# EAGLE design pi_zero (EAGLE 9.1.3)
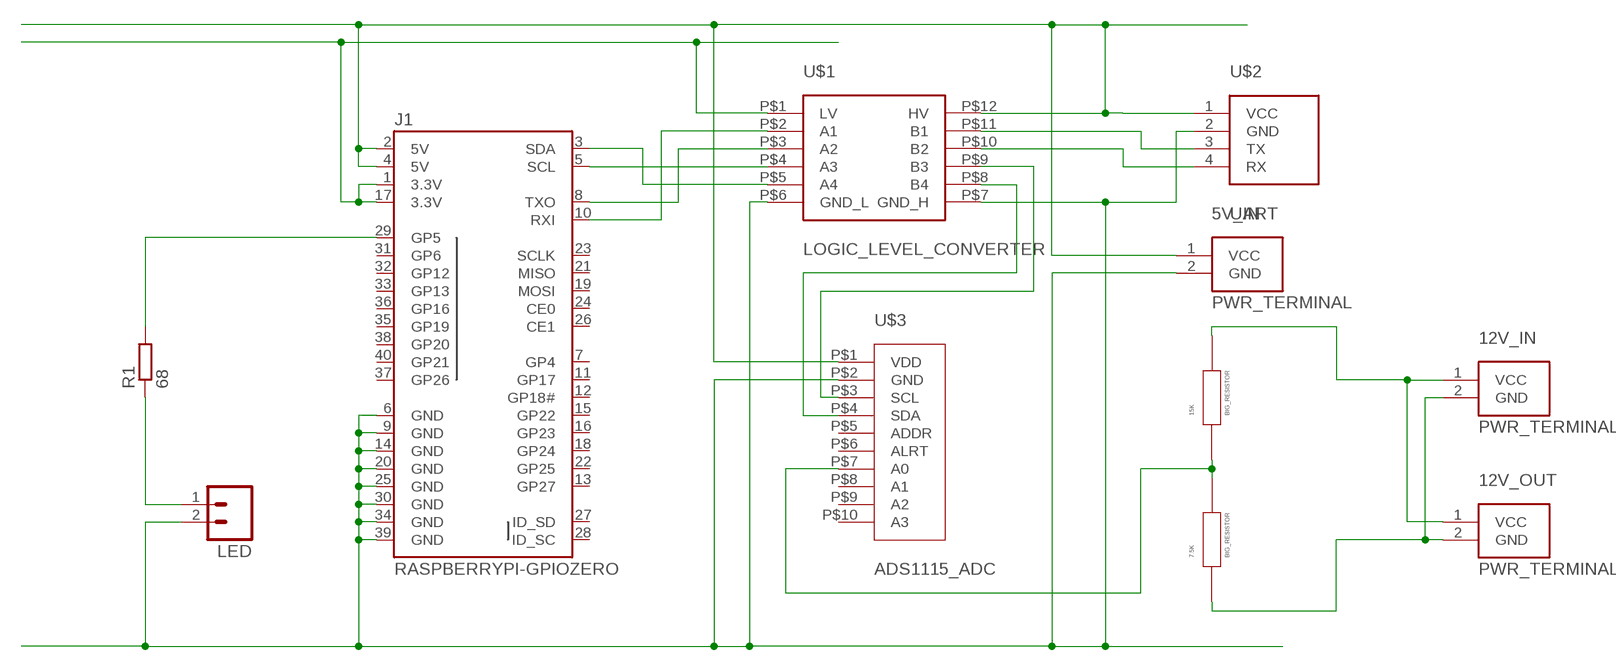
[diagram p0: schematic, sheet 1]

## Parts
5V_IN  PWR_TERMINAL  [PWR_TERMINAL]
7.5K  BIG_RESISTOR  [BIG_RESISTOR]
12V_IN  PWR_TERMINAL  [PWR_TERMINAL]
12V_OUT  PWR_TERMINAL  [PWR_TERMINAL]
15K  BIG_RESISTOR  [BIG_RESISTOR]
J1  RASPBERRYPI-GPIOZERO  [2X20-ZERO]
LED  M02LOCK_LONGPADS  [1X02_LOCK_LONGPADS]
R1  68  R-EU_0204/7  [0204/7]
U$1  LOGIC_LEVEL_CONVERTER  [LOGIC_LEVEL_CONVERTER]
U$2  UART  [I2C_TERM]
U$3  ADS1115_ADC  [ADS1115_ADC]

## Nets
N$1: J1.29(GP5) R1.2
N$2: LED.1 R1.1
N$3: U$1.P$11(B1) U$2.3(TX)
N$5: 5V_IN.1(VCC) J1.2(5V) J1.4(5V) U$1.P$12(HV) U$2.1(VCC) U$3.P$1(VDD)
N$6: J1.1(3.3V) J1.17(3.3V) U$1.P$1(LV)
N$7: 5V_IN.2(GND) J1.6(GND) J1.9(GND) J1.14(GND) J1.20(GND) J1.25(GND) J1.30(GND) J1.34(GND) J1.39(GND) LED.2 U$1.P$6(GND_L) U$1.P$7(GND_H) U$2.2(GND) U$3.P$2(GND)
N$8: 7.5K.P$1 12V_IN.2(GND) 12V_OUT.2(GND)
N$9: U$1.P$10(B2) U$2.4(RX)
N$10: J1.10(RXI) U$1.P$2(A1)
N$11: J1.8(TXO) U$1.P$3(A2)
N$12: 7.5K.P$2 15K.P$1 U$3.P$7(A0)
N$14: U$1.P$9(B3) U$3.P$3(SCL)
N$15: 12V_IN.1(VCC) 12V_OUT.1(VCC) 15K.P$2
N$16: U$1.P$8(B4) U$3.P$4(SDA)
N$17: J1.3(SDA) U$1.P$5(A4)
N$18: J1.5(SCL) U$1.P$4(A3)
Unconnected: J1.7(GP4) J1.11(GP17) J1.12(GP18#) J1.13(GP27) J1.15(GP22) J1.16(GP23) J1.18(GP24) J1.19(MOSI) J1.21(MISO) J1.22(GP25) J1.23(SCLK) J1.24(CE0) J1.26(CE1) J1.27(ID_SD) J1.28(ID_SC) J1.31(GP6) J1.32(GP12) J1.33(GP13) J1.35(GP19) J1.36(GP16) J1.37(GP26) J1.38(GP20) J1.40(GP21) U$3.P$5(ADDR) U$3.P$6(ALRT) U$3.P$8(A1) U$3.P$9(A2) U$3.P$10(A3)

## Library data of the parts
5V_IN 12V_IN 12V_OUT = 000_CropQuant:PWR_TERMINAL
7.5K 15K = 000_CropQuant:BIG_RESISTOR
J1 = 000_CropQuant:RASPBERRYPI-GPIO: Second Generation Raspberry Pi GPIO Header 2x20 pin connector, as found on B, B+, A+ models.
LED = 001_SparkFun-Connectors:M02: Standard 2-pin 0.1" header. Use with - straight break away headers ( PRT-00116) - right angle break away headers (PRT-00553) - swiss pins (PRT-00743) - machine pins (PRT-00117) - female headers (PRT-00115) Molex polarized connector foot print use with: PRT-08233 with associated crimp pins and housings. 2.54_SCREWTERM for use with PRT-10571. 3.5mm Screw Terminal footprints for PRT-08084 5mm Screw Terminal footprints for use with PRT-08432
R1 = resistor:R-EU_: RESISTOR, European symbol
U$1 = 000_CropQuant:LOGIC_LEVEL_CONVERTER
U$2 = 000_CropQuant:UART
U$3 = 000_CropQuant:ADS1115_ADC

## Board
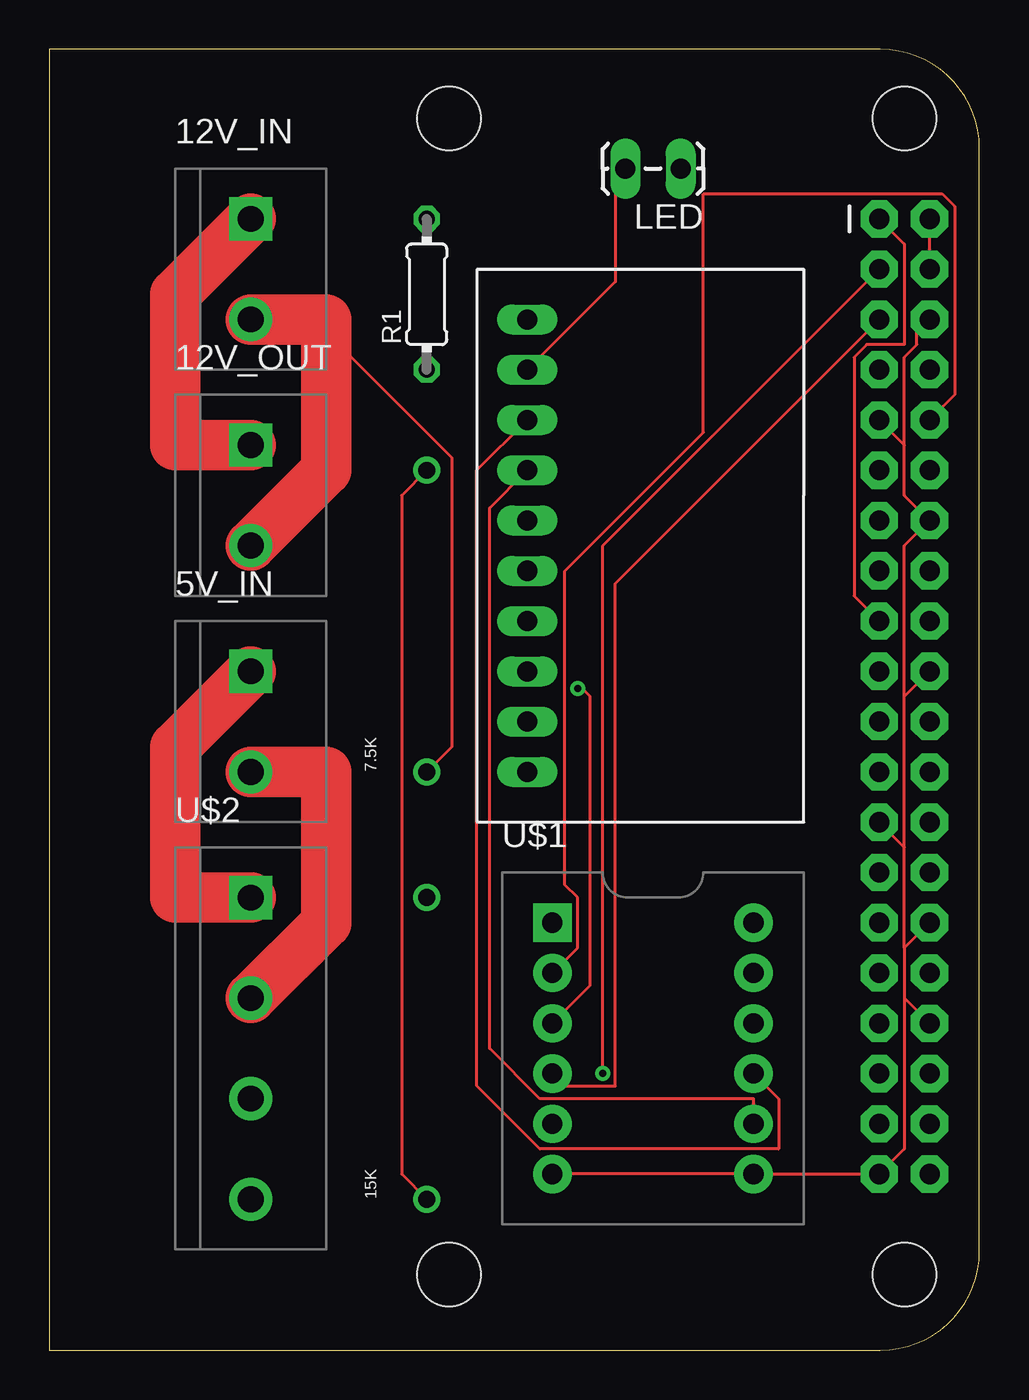
[diagram p1: board, top side]
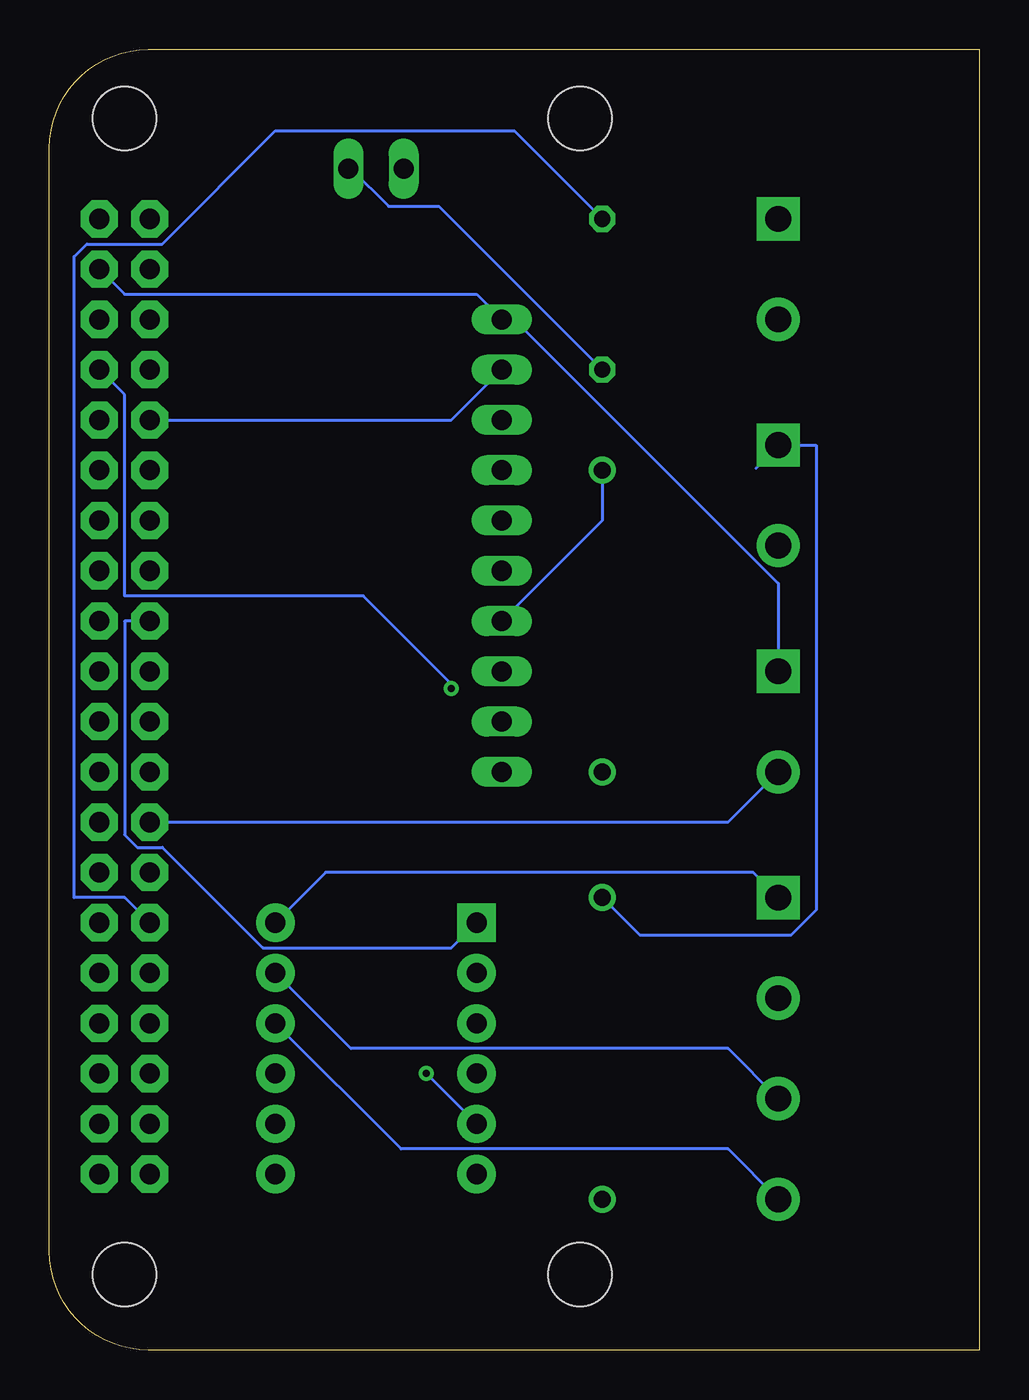
[diagram p2: board, bottom side, seen from below]

Size 46.97 x 65.71 mm. Coordinates in mm from the lower left corner, seen from the top.
Outline: 41.97,65.71 0,65.71 0,0 41.97,0 arc90 46.97,5 46.97,60.71 arc90 41.97,65.71
Copper layers (1*16): Top 0.035mm / dielectric 1.5mm / Bottom 0.035mm
Design rules "default": minimum track width 6mil, minimum drill 0.35mm, track to track 6mil, track to pad 6mil, pad to pad 6mil, via to via 6mil, smd to smd 6mil, copper to edge 40mil, drill to drill 6mil, minimum pad ring 10mil, minimum via ring 8mil, stop-mask expansion 4mil, vias tented up to drill 0mil, thermal gap 10mil

### Footprints (pad centres in the part's own frame; a part is rotated, then mirrored left to right if it is on the bottom)
PWR_TERMINAL = drill 1.3 pad 2.184 square: 1 0,2.54 | drill 1.3 pad 2.184: 2 0,-2.54
BIG_RESISTOR = drill 0.85: P$1 -7.62,0; P$2 7.62,0
2X20-ZERO = drill 1.016 pad 1.88 octagon: 1 -1.27,24.13; 2 1.27,24.13; 3 -1.27,21.59; 4 1.27,21.59; 5 -1.27,19.05; 6 1.27,19.05; 7 -1.27,16.51; 8 1.27,16.51; 9 -1.27,13.97; 10 1.27,13.97; 11 -1.27,11.43; 12 1.27,11.43; 13 -1.27,8.89; 14 1.27,8.89; 15 -1.27,6.35; 16 1.27,6.35; 17 -1.27,3.81; 18 1.27,3.81; 19 -1.27,1.27; 20 1.27,1.27; 21 -1.27,-1.27; 22 1.27,-1.27; 23 -1.27,-3.81; 24 1.27,-3.81; 25 -1.27,-6.35; 26 1.27,-6.35; 27 -1.27,-8.89; 28 1.27,-8.89; 29 -1.27,-11.43; 30 1.27,-11.43; 31 -1.27,-13.97; 32 1.27,-13.97; 33 -1.27,-16.51; 34 1.27,-16.51; 35 -1.27,-19.05; 36 1.27,-19.05; 37 -1.27,-21.59; 38 1.27,-21.59; 39 -1.27,-24.13; 40 1.27,-24.13 | hole 3.2: 0,29.21; 0,-29.21; -23,29.21; -23,-29.21
1X02_LOCK_LONGPADS = drill 1.016 long: 1 -0.127,0; 2 2.667,0
0204/7 = drill 0.813 octagon: 1 -3.81,0; 2 3.81,0
LOGIC_LEVEL_CONVERTER = drill 1.016 pad 1.93 square: P$1 -5.08,6.35 | drill 1.016 pad 1.93: P$2 -5.08,3.81; P$3 -5.08,1.27; P$4 -5.08,-1.27; P$5 -5.08,-3.81; P$6 -5.08,-6.35; P$7 5.08,-6.35; P$8 5.08,-3.81; P$9 5.08,-1.27; P$10 5.08,1.27; P$11 5.08,3.81; P$12 5.08,6.35
I2C_TERM = drill 1.3 pad 2.184 square: 1 0,7.62 | drill 1.3 pad 2.184: 2 0,2.54; 3 0,-2.54; 4 0,-7.62
ADS1115_ADC = drill 1.016 long: P$1 0,7.62; P$2 0,5.08; P$3 0,2.54; P$4 0,0; P$5 0,-2.54; P$6 0,-5.08; P$7 0,-7.62; P$8 0,-10.16; P$9 0,-12.7; P$10 0,-15.24

### Placement (x,y rotation side)
5V_IN  10.16,31.75 0 top
7.5K  19.05,36.83 90 top
12V_IN  10.16,54.61 0 top
12V_OUT  10.16,43.18 0 top
15K  19.05,15.24 90 top
J1  43.18,33.02 0 top
LED  31.75,59.69 180 top
R1  19.05,53.34 90 top
U$1  30.48,15.24 0 top
U$2  10.16,15.24 0 top
U$3  24.13,44.45 0 top

### Tracks (layer width: path | path; a pad name or v marks a point on that pad's centre or on a via)
N$1
  Bottom 0.152: R1.2 23.49,61.59 35.56,61.59 41.27,55.88 45.08,55.88 45.72,55.25 45.72,22.86 43.18,22.86 J1.29
N$2
  Bottom 0.152: R1.1 27.3,57.78 29.84,57.78 31.75,59.69 LED.1
N$3
  Bottom 0.152: U$1.P$11 31.75,15.24 12.7,15.24 U$2.3
N$5
  Top 0.152: J1.4 J1.2
  Top 2.54: 5V_IN.1 6.35,30.48 6.35,22.86 U$2.1
  Bottom 0.152: 10.67,34.34 10.21,34.34 5V_IN.1 10.16,38.73 23.49,52.07 U$3.P$1 25.4,53.34 43.18,53.34 J1.4 | U$1.P$12 33.02,24.13 11.43,24.13 U$2.1
N$6
  Top 0.152: J1.17 40.64,38.1 40.64,50.16 41.27,50.8 43.18,50.8 43.18,55.88 J1.1
  Bottom 0.152: U$1.P$1 26.67,20.32 36.19,20.32 41.27,25.4 42.55,25.4 43.18,26.03 43.18,36.83 J1.17
N$7
  Top 0.152: U$1.P$6 U$1.P$7 J1.39 43.18,10.16 43.18,17.78 | U$3.P$2 28.58,53.97 28.58,59.69 LED.2 | 43.18,45.72 J1.9 | 43.18,45.72 43.18,43.18 J1.14 43.18,40.64 43.18,33.02 | J1.6 43.81,51.44 43.81,50.8 43.18,50.16 43.18,45.72 | 43.18,17.78 J1.34 | 43.18,20.32 43.18,17.78 | J1.30 43.18,20.32 | 43.18,25.4 J1.25 | 43.18,20.32 43.18,25.4 | 43.18,33.02 J1.20 | 43.18,25.4 43.18,33.02
  Top 2.54: U$2.2 13.97,21.59 13.97,29.21 5V_IN.2
  Bottom 0.152: U$3.P$2 26.67,46.99 J1.9 | 5V_IN.2 12.7,26.67 J1.25
N$8
  Top 0.152: 7.5K.P$1 20.32,30.48 20.32,45.09 14.6,50.8 13.97,50.8
  Top 2.54: 12V_IN.2 13.97,52.07 13.97,50.8 13.97,44.45 12V_OUT.2
N$9
  Bottom 0.152: U$1.P$10 29.21,10.16 12.7,10.16 U$2.4
N$10
  Top 0.152: J1.10 45.72,48.26 45.72,57.78 45.08,58.42 33.02,58.42 33.02,46.36 26.03,39.37 26.03,23.49 26.67,22.86 26.67,20.32 U$1.P$2
N$11  (via drill 0.35)
  Top 0.152: U$1.P$3 27.3,18.41 27.3,33.02 26.67,33.66 v26.67,33.43
  Bottom 0.152: J1.8 43.18,48.26 43.18,38.1 31.11,38.1 26.67,33.66 v26.67,33.43
N$12
  Top 0.152: 15K.P$1 17.78,8.89 17.78,43.18 7.5K.P$2
  Bottom 0.152: U$3.P$7 19.05,41.91 7.5K.P$2
N$14
  Top 0.152: U$3.P$3 21.59,44.45 21.59,13.33 24.77,10.16 36.83,10.16 36.83,12.7 U$1.P$9
N$15
  Top 2.54: 12V_OUT.1 6.35,45.72 6.35,53.34 12V_IN.1
  Bottom 0.152: 11.28,44.55 10.21,45.62 12V_OUT.1 8.25,45.72 8.25,22.23 9.52,20.95 17.14,20.95 15K.P$2
N$16
  Top 0.152: U$3.P$4 22.22,42.55 22.22,15.24 24.77,12.7 35.56,12.7 U$1.P$8
N$17  (via drill 0.35)
  Top 0.152: J1.3 27.94,40.64 v27.94,13.97
  Bottom 0.152: U$1.P$5 v27.94,13.97
N$18
  Top 0.152: J1.5 28.58,38.73 28.58,13.33 25.4,13.33 U$1.P$4

### Text on the board
tDocu: LED | 12V IN | 68 | 12V OUT | ADC | 7.5K | 5V IN | 15K | LLC